# Altium schematic sheet SDRAMPart.SchDoc
size 420 x 297 mm; Address1: Address1; Address2: Address2; Address3: Address3; Address4: Address4; SheetNumber: 1; Scale: 1:1; Разраб.: Иванов; Обозначение документа: АБВГ.123456.001 Э3; Пров.: Петров; Утв.: Сидоров; Наименование организации: ОАО "Концерн "МПО-Гидроприбор"; Перв. применение: АБВГ.123456.000; Наименование изделия 1: Плата; Наименование изделия 2: Схема электрическая; Наименование изделия 3: принципиальная; Нач. отд.: Нач. отд.; Фамилия нач. отд.: Сидоров
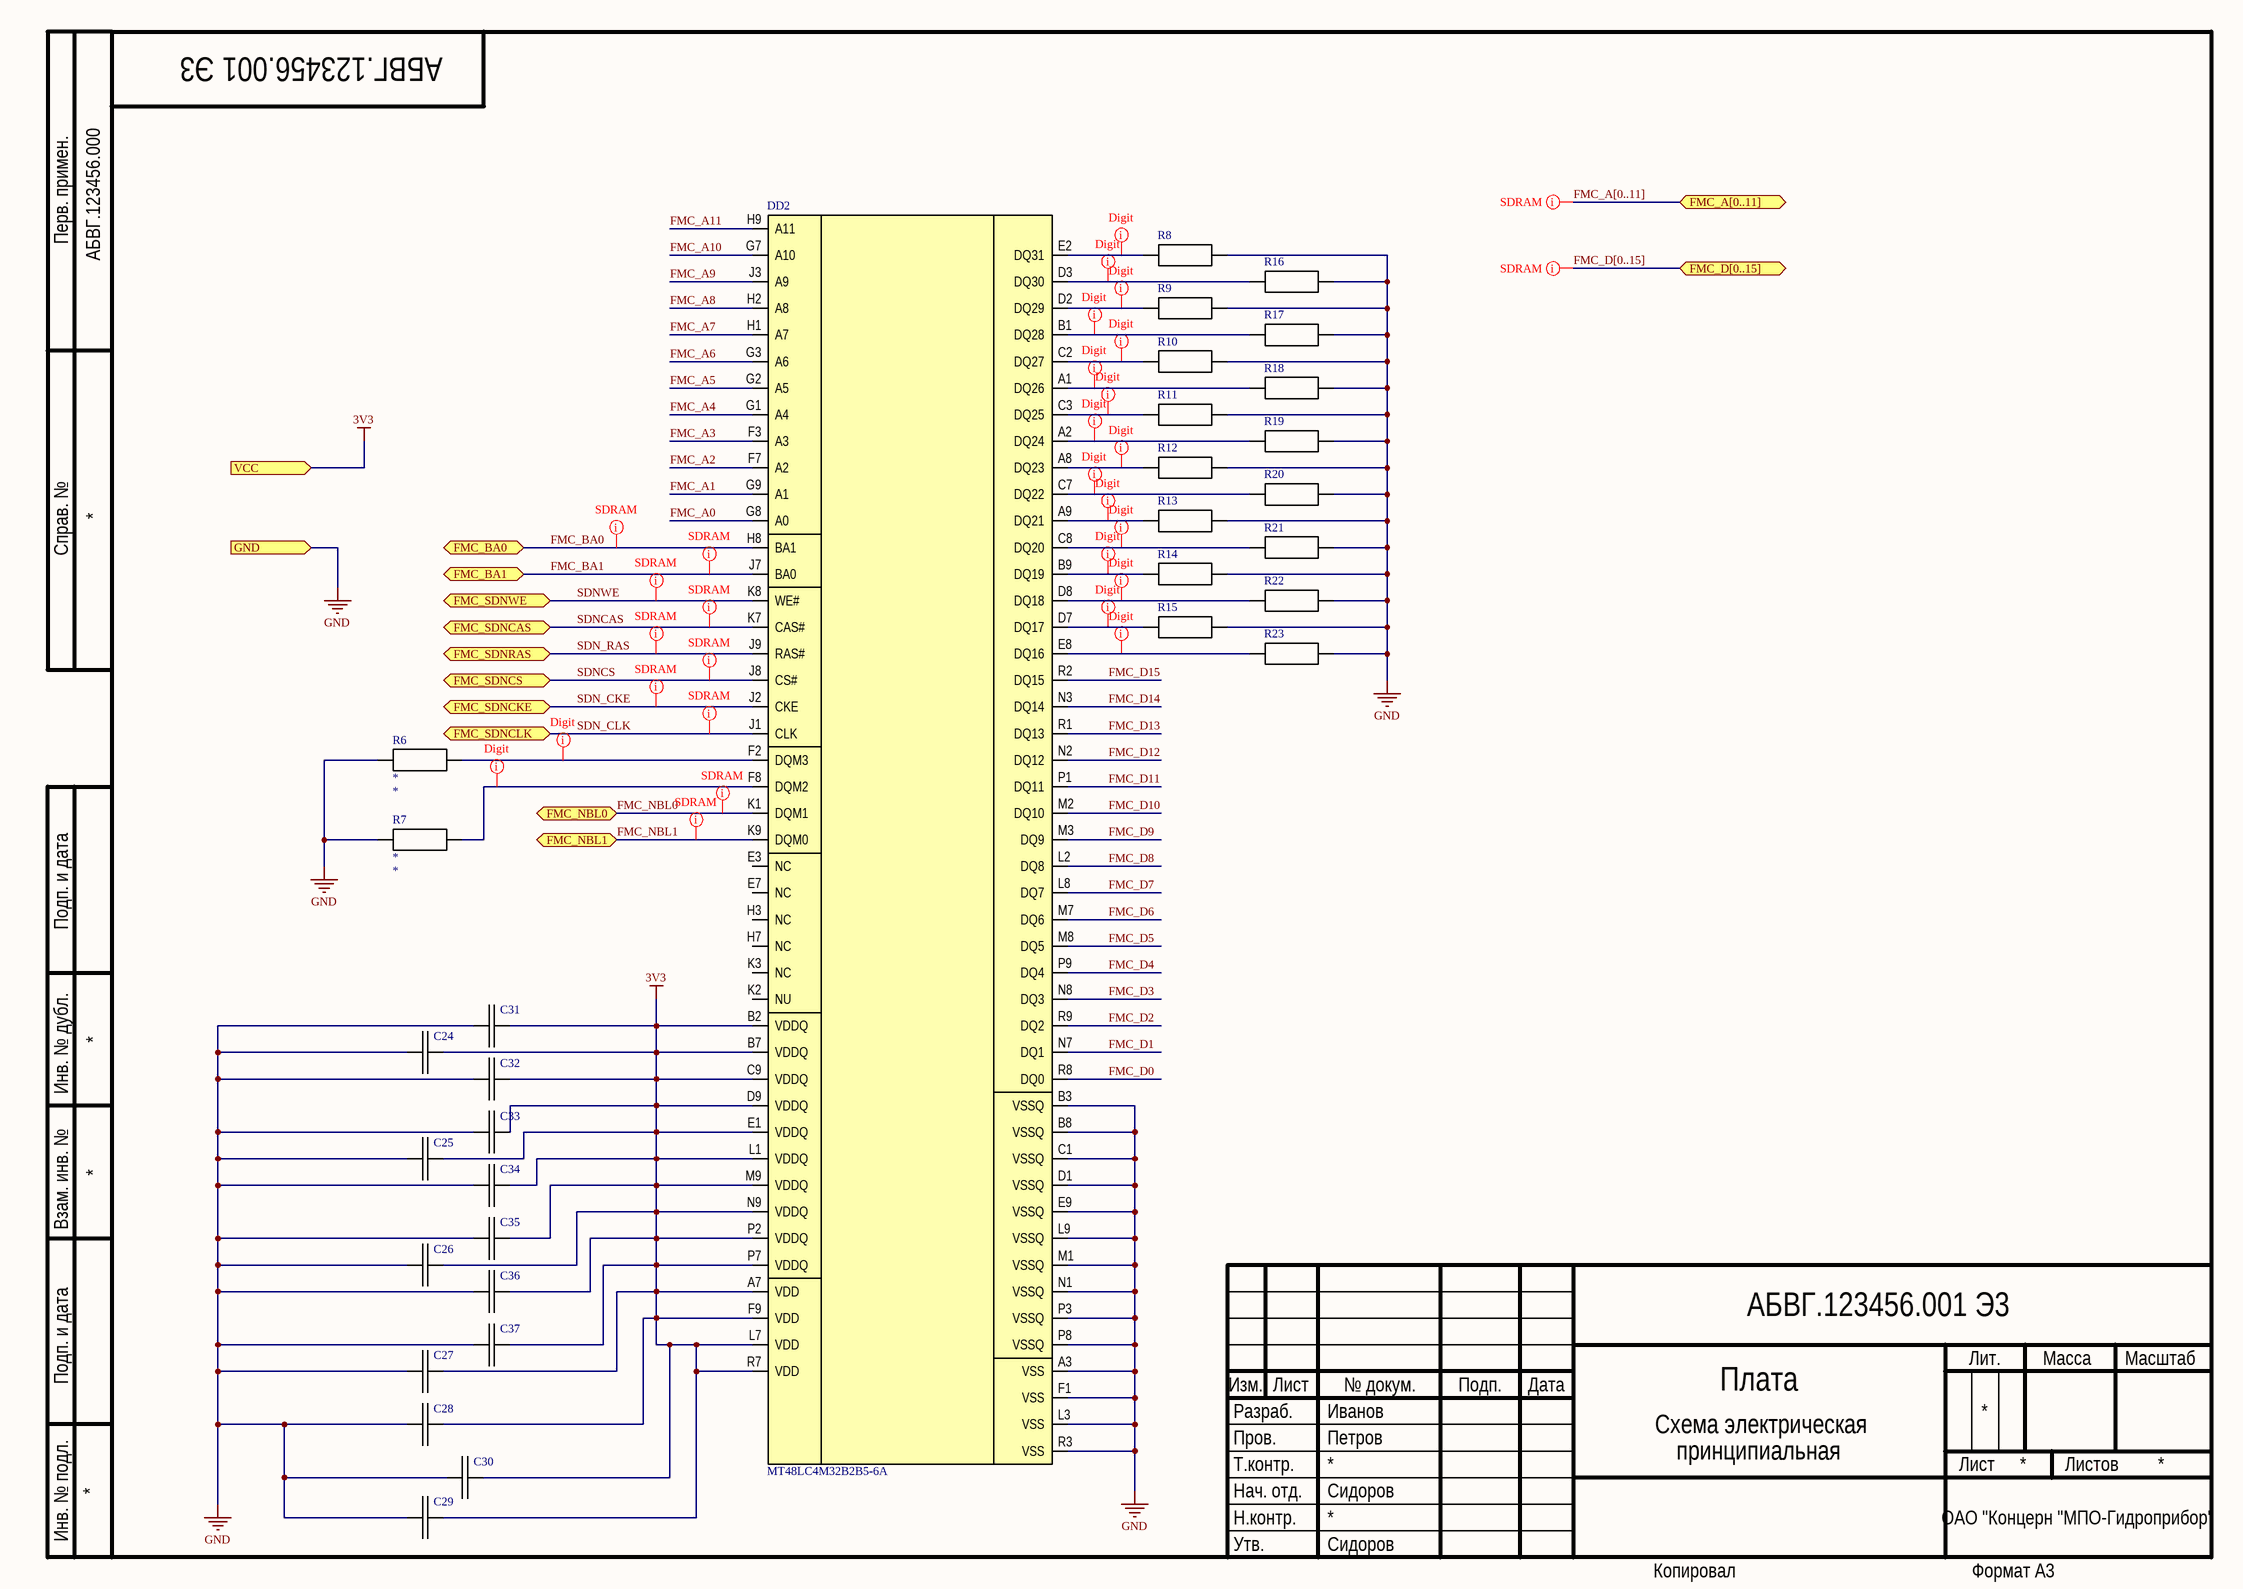
[diagram p0: SDRAMPart.SchDoc]

## Parts
C24  *  [CAP1206]  (value not drawn)
C25  *  [CAP1206]  (value not drawn)
C26  *  [CAP1206]  (value not drawn)
C27  *  [CAP1206]  (value not drawn)
C28  *  [CAP1206]  (value not drawn)
C29  *  [CAP1206]  (value not drawn)
C30  *  [CAP1206]  (value not drawn)
C31  *  [CAP1206]  (value not drawn)
C32  *  [CAP1206]  (value not drawn)
C33  *  [CAP1206]  (value not drawn)
C34  *  [CAP1206]  (value not drawn)
C35  *  [CAP1206]  (value not drawn)
C36  *  [CAP1206]  (value not drawn)
C37  *  [CAP1206]  (value not drawn)
DD2  MT48LC4M32B2B5-6A  [VFBGA90]
R6  *  [1206]
R7  *  [1206]
R8  *  [0402]  (value not drawn)
R9  *  [0402]  (value not drawn)
R10  *  [0402]  (value not drawn)
R11  *  [0402]  (value not drawn)
R12  *  [0402]  (value not drawn)
R13  *  [0402]  (value not drawn)
R14  *  [0402]  (value not drawn)
R15  *  [0402]  (value not drawn)
R16  *  [0402]  (value not drawn)
R17  *  [0402]  (value not drawn)
R18  *  [0402]  (value not drawn)
R19  *  [0402]  (value not drawn)
R20  *  [0402]  (value not drawn)
R21  *  [0402]  (value not drawn)
R22  *  [0402]  (value not drawn)
R23  *  [0402]  (value not drawn)

## Ports
FMC_A[0..11] (bidir), FMC_BA0 (bidir), FMC_BA1 (bidir), FMC_D[0..15] (bidir), FMC_NBL0 (bidir), FMC_NBL1 (bidir), FMC_SDNCAS (bidir), FMC_SDNCKE (bidir), FMC_SDNCLK (bidir), FMC_SDNCS (bidir), FMC_SDNRAS (bidir), FMC_SDNWE (bidir), GND (in), VCC (in)

## Nets
3V3: C24.2 C25.2 C26.2 C27.2 C28.2 C29.2 C30.2 C31.2 C32.2 C33.2 C34.2 C35.2 C36.2 C37.2 DD2.A7(VDD) DD2.B2(VDDQ) DD2.B7(VDDQ) DD2.C9(VDDQ) DD2.D9(VDDQ) DD2.E1(VDDQ) DD2.F9(VDD) DD2.L1(VDDQ) DD2.L7(VDD) DD2.M9(VDDQ) DD2.N9(VDDQ) DD2.P2(VDDQ) DD2.P7(VDDQ) DD2.R7(VDD) ; port VCC
GND: C24.1 C25.1 C26.1 C27.1 C28.1 C29.1 C30.1 C31.1 C32.1 C33.1 C34.1 C35.1 C36.1 C37.1 DD2.A3(VSS) DD2.B3(VSSQ) DD2.B8(VSSQ) DD2.C1(VSSQ) DD2.D1(VSSQ) DD2.E9(VSSQ) DD2.F1(VSS) DD2.L3(VSS) DD2.L9(VSSQ) DD2.M1(VSSQ) DD2.N1(VSSQ) DD2.P3(VSSQ) DD2.P8(VSSQ) DD2.R3(VSS) R6.1 R7.1 R8.2 R9.2 R10.2 R11.2 R12.2 R13.2 R14.2 R15.2 R16.2 R17.2 R18.2 R19.2 R20.2 R21.2 R22.2 R23.2 ; port GND
FMC_A0: DD2.G8(A0)
FMC_A1: DD2.G9(A1)
FMC_A2: DD2.F7(A2)
FMC_A3: DD2.F3(A3)
FMC_A4: DD2.G1(A4)
FMC_A5: DD2.G2(A5)
FMC_A6: DD2.G3(A6)
FMC_A7: DD2.H1(A7)
FMC_A8: DD2.H2(A8)
FMC_A9: DD2.J3(A9)
FMC_A10: DD2.G7(A10)
FMC_A11: DD2.H9(A11)
FMC_BA0: DD2.H8(BA1) ; port FMC_BA0
FMC_BA1: DD2.J7(BA0) ; port FMC_BA1
FMC_D0: DD2.R8(DQ0)
FMC_D1: DD2.N7(DQ1)
FMC_D2: DD2.R9(DQ2)
FMC_D3: DD2.N8(DQ3)
FMC_D4: DD2.P9(DQ4)
FMC_D5: DD2.M8(DQ5)
FMC_D6: DD2.M7(DQ6)
FMC_D7: DD2.L8(DQ7)
FMC_D8: DD2.L2(DQ8)
FMC_D9: DD2.M3(DQ9)
FMC_D10: DD2.M2(DQ10)
FMC_D11: DD2.P1(DQ11)
FMC_D12: DD2.N2(DQ12)
FMC_D13: DD2.R1(DQ13)
FMC_D14: DD2.N3(DQ14)
FMC_D15: DD2.R2(DQ15)
FMC_NBL0: DD2.K1(DQM1) ; port FMC_NBL0
FMC_NBL1: DD2.K9(DQM0) ; port FMC_NBL1
SDN_CKE: DD2.J2(CKE) ; port FMC_SDNCKE
SDN_CLK: DD2.J1(CLK) ; port FMC_SDNCLK
SDN_RAS: DD2.J9(RAS#) ; port FMC_SDNRAS
SDNCAS: DD2.K7(CAS#) ; port FMC_SDNCAS
SDNCS: DD2.J8(CS#) ; port FMC_SDNCS
SDNWE: DD2.K8(WE#) ; port FMC_SDNWE
NetDD2_A1: DD2.A1(DQ26) R18.1
NetDD2_A2: DD2.A2(DQ24) R19.1
NetDD2_A8: DD2.A8(DQ23) R12.1
NetDD2_A9: DD2.A9(DQ21) R13.1
NetDD2_B1: DD2.B1(DQ28) R17.1
NetDD2_B9: DD2.B9(DQ19) R14.1
NetDD2_C2: DD2.C2(DQ27) R10.1
NetDD2_C3: DD2.C3(DQ25) R11.1
NetDD2_C7: DD2.C7(DQ22) R20.1
NetDD2_C8: DD2.C8(DQ20) R21.1
NetDD2_D2: DD2.D2(DQ29) R9.1
NetDD2_D3: DD2.D3(DQ30) R16.1
NetDD2_D7: DD2.D7(DQ17) R15.1
NetDD2_D8: DD2.D8(DQ18) R22.1
NetDD2_E2: DD2.E2(DQ31) R8.1
NetDD2_E8: DD2.E8(DQ16) R23.1
NetDD2_F2: DD2.F2(DQM3) R6.2
NetDD2_F8: DD2.F8(DQM2) R7.2

Not connected (* = marked no-connect by the designer): DD2 E3(NC) E7(NC) H3(NC) H7(NC) K2(NU) K3(NC)

## Buses and harness runs
bus FMC_A[0..11] = port FMC_A[0..11]
bus FMC_D[0..15] = port FMC_D[0..15]

## Layout directives
net class SDRAM: (no net found under the mark), FMC_BA0, FMC_BA1, FMC_NBL0, FMC_NBL1, SDN_CKE, SDN_CLK, SDN_RAS, SDNCAS, SDNCS, SDNWE
net class DIGIT: NetDD2_A1, NetDD2_A2, NetDD2_A8, NetDD2_A9, NetDD2_B1, NetDD2_B9, NetDD2_C2, NetDD2_C3, NetDD2_C7, NetDD2_C8, NetDD2_D2, NetDD2_D3, NetDD2_D7, NetDD2_D8, NetDD2_E2, NetDD2_E8, NetDD2_F2, NetDD2_F8

## Notes on the sheet
- Перв. примен.
- Справ. №
- Подп. и дата
- Инв. № дубл.
- Взам. инв. №
- Разраб.
- Изм.
- Лист
- № докум.
- Подп.
- Дата
- Лит.
- Масса
- Масштаб
- Пров.
- Т.контр.
- Листов
- Инв. № подл.
- Утв.
- Н.контр.
- Копировал
- Формат А3

## Library data of the parts
C24-C37 = Capasitor: Value: *; Voltage: *; Part Number: *; Quantity: *; Package: *; Price: *; Manufacturer: *; ShoppingPlace: *
DD2 = mt48lc4m32b2b5-6a: Manufacturer: MICRON; Part Number: MT48LC4M32B2B5-6A; Price: 10; Package: VBGA90; Quantity: 1; Documantation: https://www.micron.com/parts/dram/sdram/mt48lc4m32b2b5-6a-it
R6-R23 = Resistor: Manufacturer: *; Quntity: *; Price: *; Part Number: *; Package: *; Value: *; Power: *